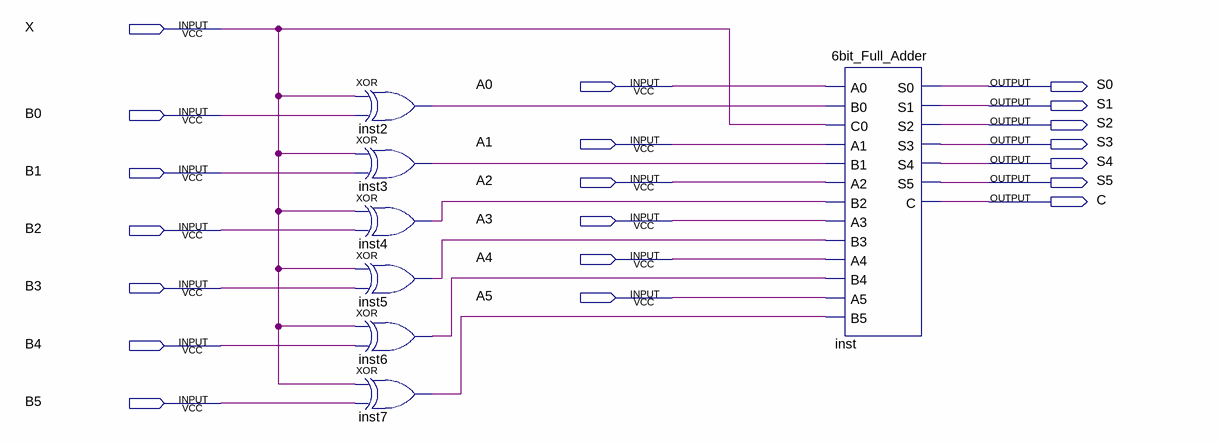
[diagram p0: schematic sheet]
// Quartus schematic FPGA_6bit_Adder_Subtractor_Version2.bdf as structural Verilog: 7 symbols, 20 pins
module FPGA_6bit_Adder_Subtractor_Version2 (
  input  X,
  input  A0,
  input  B0,
  input  A1,
  input  B1,
  input  A2,
  input  A3,
  input  B2,
  input  A4,
  input  B3,
  input  A5,
  input  B4,
  input  B5,
  output S0,
  output S1,
  output S2,
  output S3,
  output S4,
  output S5,
  output C
);

  wire inst2_out, inst3_out, inst4_out, inst5_out, inst6_out, inst7_out;

  xor inst2 (inst2_out, X, B0);
  xor inst3 (inst3_out, X, B1);
  xor inst4 (inst4_out, X, B2);
  xor inst5 (inst5_out, X, B3);
  xor inst6 (inst6_out, X, B4);
  xor inst7 (inst7_out, X, B5);
  \6bit_Full_Adder  inst (
    .A0(A0), .B0(inst2_out), .C0(X), .A1(A1), .B1(inst3_out), .A2(A2), .B2(inst4_out), .A3(A3),
    .B3(inst5_out), .A4(A4), .B4(inst6_out), .A5(A5), .B5(inst7_out), .S0(S0), .S1(S1), .S2(S2), .S3(S3),
    .S4(S4), .S5(S5), .C(C));
endmodule
